# Altium schematic sheet GoodBoy_V1_nRF9160dk_sim_connector.SchDoc
size A3
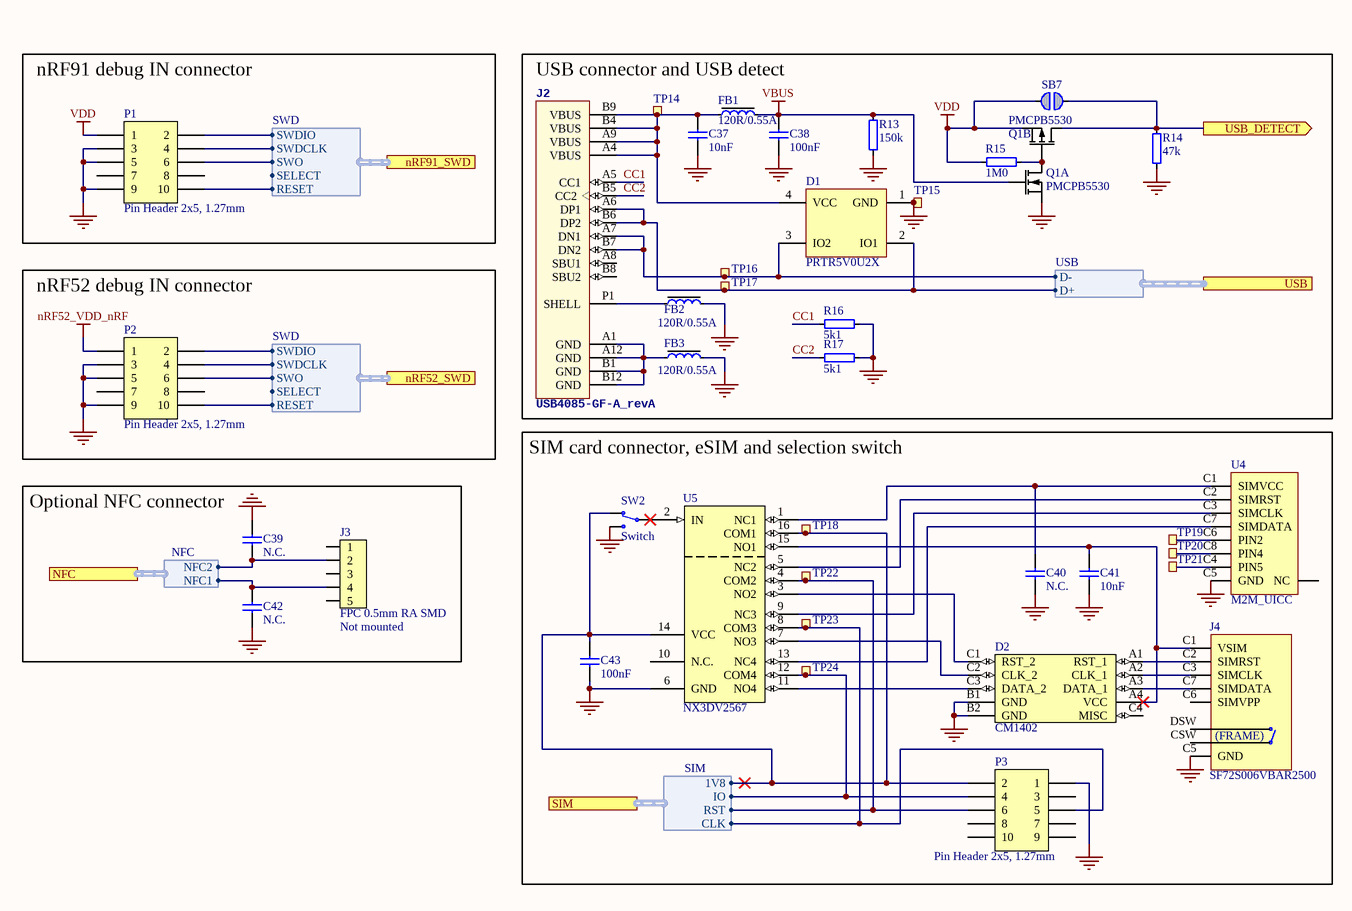
[diagram p0: GoodBoy_V1_nRF9160dk_sim_connector.SchDoc]

## Parts
C37  10nF  [CAPC0603X03L_C]
C38  100nF  [CAPC0603X03L_C]
C39  N.C.  [CAPC0603X03L_C]
C40  N.C.  [CAPC0603X03L_C]
C41  10nF  [CAPC0603X03L_C]
C42  N.C.  [CAPC0603X03L_C]
C43  100nF  [CAPC0603X03L_C]
D1  PRTR5V0U2X  [SOT190P230X110-4L]
D2  CM1402  [CM1402]
FB1  120R/0.55A  [INDC1005X04L]
FB2  120R/0.55A  [INDC1005X04L]
FB3  120R/0.55A  [INDC1005X04L]
J2  USB4085-GF-A_revA  [GCT_USB4085-GF-A_REVA]
J3  FPC 0.5mm RA SMD  Assembly: Not mounted  [FPC_05P-0.5mm-RA-SMD]
J4  SF72S006VBAR2500  [SF72S006VBAR2500]
P1  Pin Header 2x5, 1.27mm  [HDR_2x5-SMD-1.27mm-K]
P2  Pin Header 2x5, 1.27mm  [HDR_2x5-SMD-1.27mm-K]
P3  Pin Header 2x5, 1.27mm  [HDR_2x5-SMD-1.27mm]
Q1  PMCPB5530  [PMCPB5530X]  (parts A,B of 2)
R13  150k  [RESC0603X03L_C]
R14  47k  [RESC0603X03L_C]
R15  1M0  [RESC0603X03L_C]
R16  5k1  [RESC0603X03L_C]
R17  5k1  [RESC0603X03L_C]
SB7  Solderbridge  [Solderbridge]  (value not drawn)  (no BOM)
SW2  Switch  [CJS-120xA]
TP14  Ø1.5mm,SMD  [TP_SMD_Ø1.5mm]  (value not drawn)  (no BOM)
TP15  Ø1.5mm,SMD  [TP_SMD_Ø1.5mm]  (value not drawn)  (no BOM)
TP16  Ø1.5mm,SMD  [TP_SMD_Ø1.5mm]  (value not drawn)  (no BOM)
TP17  Ø1.5mm,SMD  [TP_SMD_Ø1.5mm]  (value not drawn)  (no BOM)
TP18  Ø1.5mm,SMD  [TP_SMD_Ø1.5mm]  (value not drawn)  (no BOM)
TP19  Ø1.0mm,SMD  [TP_SMD_Ø1.0mm]  (value not drawn)  (no BOM)
TP20  Ø1.0mm,SMD  [TP_SMD_Ø1.0mm]  (value not drawn)  (no BOM)
TP21  Ø1.0mm,SMD  [TP_SMD_Ø1.0mm]  (value not drawn)  (no BOM)
TP22  Ø1.5mm,SMD  [TP_SMD_Ø1.5mm]  (value not drawn)  (no BOM)
TP23  Ø1.5mm,SMD  [TP_SMD_Ø1.5mm]  (value not drawn)  (no BOM)
TP24  Ø1.5mm,SMD  [TP_SMD_Ø1.5mm]  (value not drawn)  (no BOM)
U4  M2M_UICC  [M2M_UICC]
U5  NX3DV2567  [XQFN40P180X260X50-16N]

## Blocks framed on the sheet
nRF91 debug IN connector: P1
USB connector and USB detect: C37 C38 D1 FB1-FB3 J2 Q1 R13-R17 SB7 TP14-TP17
nRF52 debug IN connector: P2
SIM card connector, eSIM and selection switch: C40 C41 C43 D2 J4 P3 SW2 TP18-TP24 U4 U5
Optional NFC connector: C39 C42 J3

## Ports
NFC (harness NFC), nRF52_SWD (harness SWD), nRF91_SWD (harness SWD), SIM (harness SIM), USB (harness USB), USB_DETECT (out)

## Harnesses
NFC: NFC1, NFC2
USB: D+, D-
SIM: CLK, IO, 1V8, RST
SWD: SWDIO, SWDCLK, SWO, RESET, SELECT

## Nets
GND: C37.1 C38.1 C39.2 C40.1 C41.2 C42.1 C43.1 D1.1(GND) D2.B1(GND) D2.B2(GND) FB2.2 FB3.2 J4.0(GND) J4.C5(GND) P1.3 P1.5 P1.9 P2.3 P2.5 P2.9 P3.1 Q1.1(S1) R13.1 R14.1 R16.1 R17.1 SW2.3(N.O) TP15.1 U4.C5(GND) U5.6(GND)
nRF52_VDD_nRF: P2.1
VBUS: C38.2 FB1.2 Q1.2(G1) R13.2
VDD: P1.1 Q1.4(S2) R15.1 SB7.1
CC1: J2.A5(CC1) R16.2
CC2: J2.B5(CC2) R17.2
USB_DETECT: Q1.3(D2) R14.2 SB7.2 ; port USB_DETECT
NetC37_2: C37.2 D1.4(VCC) FB1.1 J2.A4(VBUS) J2.A9(VBUS) J2.B4(VBUS) J2.B9(VBUS) TP14.1
NetC39_1: C39.1 J3.2 ; port NFC.NFC2
NetC40_2: C40.2 U4.C1(SIMVCC) U5.1(NC1)
NetC41_1: C41.1 D2.A4(VCC) J4.C1(VSIM) U5.15(NO1)
NetC42_2: C42.2 J3.4 ; port NFC.NFC1
NetC43_2: C43.2 P3.2 SW2.1(N.C) TP18.1 U5.14(VCC) U5.16(COM1) ; port SIM.1V8
NetD1_2: D1.2(IO1) J2.A6(DP1) J2.B6(DP2) TP17.1 ; port USB.D+
NetD1_3: D1.3(IO2) J2.A7(DN1) J2.B7(DN2) TP16.1 ; port USB.D-
NetD2_A1: D2.A1(RST_1) J4.C2(SIMRST)
NetD2_A2: D2.A2(CLK_1) J4.C3(SIMCLK)
NetD2_A3: D2.A3(DATA_1) J4.C7(SIMDATA)
NetD2_C1: D2.C1(RST_2) U5.3(NO2)
NetD2_C2: D2.C2(CLK_2) U5.7(NO3)
NetD2_C3: D2.C3(DATA_2) U5.11(NO4)
NetFB2_1: FB2.1 J2.P1(SHELL)
NetFB3_1: FB3.1 J2.A1(GND) J2.A12(GND) J2.B1(GND) J2.B12(GND)
NetP1_2: P1.2 ; port nRF91_SWD.SWDIO
NetP1_4: P1.4 ; port nRF91_SWD.SWDCLK
NetP1_6: P1.6 ; port nRF91_SWD.SWO
NetP1_10: P1.10 ; port nRF91_SWD.RESET
NetP2_2: P2.2 ; port nRF52_SWD.SWDIO
NetP2_4: P2.4 ; port nRF52_SWD.SWDCLK
NetP2_6: P2.6 ; port nRF52_SWD.SWO
NetP2_10: P2.10 ; port nRF52_SWD.RESET
NetP3_4: P3.4 TP24.1 U5.12(COM4) ; port SIM.IO
NetP3_5: P3.5 TP23.1 U5.8(COM3) ; port SIM.CLK
NetP3_6: P3.6 TP22.1 U5.4(COM2) ; port SIM.RST
NetQ1_5: Q1.5(G2) Q1.6(D1) R15.2
NetSW2_2: SW2.2(COM) U5.2(IN)
NetTP19_1: TP19.1 U4.C6(PIN2)
NetTP20_1: TP20.1 U4.C8(PIN4)
NetTP21_1: TP21.1 U4.C4(PIN5)
NetU4_C2: U4.C2(SIMRST) U5.5(NC2)
NetU4_C3: U4.C3(SIMCLK) U5.9(NC3)
NetU4_C7: U4.C7(SIMDATA) U5.13(NC4)

Not connected (* = marked no-connect by the designer): D2 C4(MISC); J2 A8(SBU1) B8(SBU2); J3 1 3 5; J4 C6(SIMVPP) CSW DSW; P1 7 8; P2 7 8; P3 3 7 8 9 10; U4 NC; U5 10(N.C.)

## Notes on the sheet
- (in symbol SF72S006VBAR2500) (FRAME)

## Library data of the parts
C37 C41 = C0201-10n: Capacitor, X7R, ±10%; Part number IPS: 00000003480; Note: 10V; Artikkelnr Noca: N.A.; Part Number: C0201-10n; Manufacturer: *; Manufacturer Part Number: *; ComponentLink1URL: *; ComponentLink1Description: Datasheet; ComponentLink2URL: *; ComponentLink2Description: Supplier link; HelpURL: *; Footprint Doc: 0201; LatestRevisionDate: 2017-11-09; Pin Count: 2; Publisher: Nordic Semiconductor; Published: 2014-11-13; Value: 10nF; Supplier 1: *; Supplier Part Number 1: *; Supplier 2: *; Supplier Part Number 2: *
C38 C43 = C0201-100n: Capacitor, X5R, ±10%; Part number IPS: 00000001248; Note: 16V; Artikkelnr Noca: N.A.; Part Number: C0201-100n; Manufacturer: *; Manufacturer Part Number: *; ComponentLink1URL: *; ComponentLink1Description: Datasheet; ComponentLink2URL: *; ComponentLink2Description: Supplier link; HelpURL: *; Footprint Doc: 0201; LatestRevisionDate: 2017-11-09; Pin Count: 2; Publisher: Nordic Semiconductor; Published: 2014-11-13; Value: 100nF; Supplier 1: *; Supplier Part Number 1: *; Supplier 2: *; Supplier Part Number 2: *
C39 C40 C42 = C0201-N.C.: Not mounted; Note: Chip Cap; Artikkelnr Noca: N.A.; Assembly: Not mounted; Part Number: C0201-N.C.; Manufacturer: *; Manufacturer Part Number: *; ComponentLink1URL: *; ComponentLink1Description: Datasheet; ComponentLink2URL: *; ComponentLink2Description: Supplier link; HelpURL: *; Footprint Doc: 0201; LatestRevisionDate: 2014-11-13; Pin Count: 2; Publisher: Nordic Semiconductor; Published: 2014-11-13; Value: N.C.; Supplier 1: *; Supplier Part Number 1: *; Supplier 2: *; Supplier Part Number 2: *; Part number IPS: N.A.
D1 = PRTR5V0U2X: Ultra low capacitance double rail-to-rail ESD protection diode; Manufacturer: NXP; Part number IPS: 00000009951; Artikkelnr Noca: 10069015; Part Number: PRTR5V0U2X; Manufacturer Part Number: PRTR5V0U2X; LatestRevisionDate: 2017-11-09; Publisher: Nordic Semiconductor; Published: 2012-06-11; Value: PRTR5V0U2X; Note: *; Footprint Doc: SOT-143B; ComponentLink1URL: *; ComponentLink1Description: Datasheet; ComponentLink2URL: *; ComponentLink2Description: Supplier link; HelpURL: http://www.farnell.com/datasheets/109718.pdf; Pin Count: 4; Supplier 1: Digi-Key; Supplier Part Number 1: 568-4140-1-ND; Supplier 2: Farnell; Supplier Part Number 2: 152-4157
D2 = CM1402: EMI Network Filter Arrays SIM CARD EMI FILTER WITH ESD PROTECTION; Manufacturer: ON Semiconductor; Manufacturer Part Number: CM1402-03CP; Part number IPS: 00000009949; Artikkelnr Noca: N.A.; Part Number: CM1402; Footprint Doc: CM1402; LatestRevisionDate: 2017-02-06; Publisher: Nordic Semiconductor; Published: 2017-02-06; Value: CM1402; Note: *; ComponentLink1URL: *; ComponentLink1Description: Datasheet; ComponentLink2URL: *; ComponentLink2Description: Supplier link; HelpURL: http://www.onsemi.com/pub_link/Collateral/CM1402-D.PDF; Pin Count: 10; Supplier 1: Digi-Key; Supplier Part Number 1: CM1402-03CPOSTR-ND; Supplier 2: Mouser; Supplier Part Number 2: 748-CM1402-03CP
FB1-FB3 = FB0402-120R@100M-500mA: Ferrite Bead, 120 Ohm @ 100MHz, 500mA, 250 mOhm Max; Manufacturer: Murata; Manufacturer Part Number: BLM15AG121SN1D; Part number IPS: 00000009954; Note: Chip EMIFIL Inductor Type Chip Ferrite Bead; Artikkelnr Noca: 33029317; Part Number: FB0402-120R@100M-500mA; Footprint Doc: 0402; LatestRevisionDate: 2014-01-10; Pin Count: 2; Publisher: Nordic Semiconductor; Published: 2011-11-14; Value: 120R/0.55A; ComponentLink1URL: *; ComponentLink1Description: Datasheet; ComponentLink2URL: *; ComponentLink2Description: Supplier link; HelpURL: http://search.murata.co.jp/Ceramy/image/img/PDF/ENG/L0110S0100BLM15A_SN.pdf; Supplier 1: Digi-Key; Supplier Part Number 1: 490-1005-1-ND; Supplier 2: Farnell; Supplier Part Number 2: 151-5760
J2 = USB4085-GF-A_revA: USB 2.0 Type C Receptacle Dip Type, PCB Top Mount; MANUFACTURER: Global Connector Technology; PARTREV: A; STANDARD: Manufacturer Recommendations
J3 = FPC_05P-0.5mm-RA-SMD: 0.5mm FPC, 5P,Right Angle SMT,Double Contact,H=1.2mm,White, Tin plated; Manufacturer: W-CON; Manufacturer Part Number: 5141-05RZDNWR01; Part number IPS: 00000007792; Artikkelnr Noca: 55010020; Part Number: FPC_05P-0.5mm-RA-SMD; Footprint Doc: FPC_05P-0.5mm-RA-SMD; LatestRevisionDate: 2016-04-21; Pin Count: 7; Publisher: Nordic Semiconductor; Published: 2015-06-22; Value: FPC 0.5mm RA SMD; Note: *; ComponentLink1URL: *; ComponentLink1Description: Datasheet; ComponentLink2URL: *; ComponentLink2Description: Supplier link; HelpURL: \\hizz\pro\app9717\Datasheet\connectores\W-CON\5141-XXRZDNXX0X.pdf; Supplier 1: Cabcon; Supplier Part Number 1: 5141-05RZDNWR01; Supplier 2: Digi-Key; Supplier Part Number 2: WM9836CT-ND
J4 = SF72S006VBAR2500: n 8 (6 + 2) Position Card Connector NANO SIM Surface Mount, Right Angle Gold; Manufacturer: JAE; Part number IPS: 00000009956; Artikkelnr Noca: N.A.; Part Number: SF72S006VBAR2500; Manufacturer Part Number: SF72S006VBAR2500; Footprint Doc: SF72S006VBAR2500; LatestRevisionDate: 2016-09-09; Pin Count: 8; Publisher: Nordic Semiconductor; Published: 2016-09-09; Value: SF72S006VBAR2500; Note: *; ComponentLink1URL: *; ComponentLink1Description: Datasheet; ComponentLink2URL: *; ComponentLink2Description: Supplier link; HelpURL: http://jae-connectors.com/en/pdf/MB-0282-1E_SF72.pdf; Supplier 1: Digi-Key; Supplier Part Number 1: 670-2799-1-ND; Supplier 2: Mouser; Supplier Part Number 2: 656-SF72S006VBAR2500
P1 P2 = Pin Header 2x5 SMD, 1.27mm, KS: Pin Header 2x5, 1.27mm (50mil), SMD, Keying Shroud; Manufacturer: W-CON; Manufacturer Part Number: 3132-10MS0BK00R1; Part number IPS: 00000009968; Artikkelnr Noca: 55010009; Part Number: Pin Header 2x5 SMD, 1.27mm, KS; Footprint Doc: HDR_2x5-SMD-1.27mm; LatestRevisionDate: 2016-04-21; Pin Count: 10; Publisher: Nordic Semiconductor; Published: 2016-01-22; Value: Pin Header 2x5, 1.27mm; Note: *; ComponentLink1URL: *; ComponentLink1Description: Datasheet; ComponentLink2URL: *; ComponentLink2Description: Supplier link; HelpURL: \\hizz\pro\app9717\Datasheet\connectores\W-CON\3132-XXMXXBK00XX.pdf; Supplier 1: Cabcon; Supplier Part Number 1: 3132-10MS0BK00R1; Supplier 2: Samtec; Supplier Part Number 2: FTSH-105-01-F-DV-K
P3 = Pin Header 2x5 SMD, 1.27mm: Pin Header 2x5, 1.27mm (50mil), SMD; Manufacturer: W-CON; Manufacturer Part Number: 1325-1205S0M078R1; Part number IPS: 00000009970; Artikkelnr Noca: 55019196; Part Number: Pin Header 2x5 SMD, 1.27mm; Footprint Doc: HDR_2x5-SMD-1.27mm; LatestRevisionDate: 2016-04-21; Pin Count: 10; Publisher: Nordic Semiconductor; Published: 2010-11-25; Value: Pin Header 2x5, 1.27mm; Note: *; ComponentLink1URL: *; ComponentLink1Description: Datasheet; ComponentLink2URL: *; ComponentLink2Description: Supplier link; HelpURL: http://www.farnell.com/datasheets/81359.pdf; Supplier 1: Cabcon; Supplier Part Number 1: 1325-1205S0M078R1; Supplier 2: Farnell; Supplier Part Number 2: 166-7759
Q1 = PMCPB5530X,115: Mosfet Array N and P-Channel 20V 4A (Ta), 3.4A (Ta) 490mW Surface Mount 6-HUSON-EP (2x2); Manufacturer: Nexperia; Artikkelnr Noca: N.A.; Part Number: PMCPB5530X,115; Manufacturer Part Number: PMCPB5530X,115; LatestRevisionDate: 2018-04-30; Pin Count: 8; Publisher: Nordic Semiconductor; Published: 2018-04-30; Value: PMCPB5530; Note: *; Footprint Doc: 6-UDFN; Part number IPS: N.A.; ComponentLink1URL: https://assets.nexperia.com/documents/data-sheet/PMCPB5530X.pdf; ComponentLink1Description: Datasheet; ComponentLink2URL: https://www.digikey.com/product-detail/en/nexperia-usa-inc/PMCPB5530X115/1727-1327-1-ND/4386339; ComponentLink2Description: Supplier link; HelpURL: https://www.nexperia.com/products/mosfets/small-signal-mosfets/PMCPB5530X.html; Supplier 1: Digi-Key; Supplier Part Number 1: 1727-1327-1-ND; Supplier 2: Mouser; Supplier Part Number 2: 771-PMCPB5530X115
R13 = R0201-150k: Resistor, ±1%, 0.05W; Part number IPS: 00000001422; Note: Chip Res 1%; Artikkelnr Noca: N.A.; Part Number: R0201-150k; Manufacturer: *; Manufacturer Part Number: *; ComponentLink1URL: *; ComponentLink1Description: Datasheet; ComponentLink2URL: *; ComponentLink2Description: Supplier link; HelpURL: *; Footprint Doc: 0201; LatestRevisionDate: 2014-11-13; Pin Count: 2; Publisher: Nordic Semiconductor; Published: 2014-11-13; Value: 150k; Supplier 1: *; Supplier Part Number 1: *; Supplier 2: *; Supplier Part Number 2: *
R14 = R0201-47k: Resistor, ±1%, 0.05W; Part number IPS: 00000001423; Note: Chip Res 1%; Artikkelnr Noca: N.A.; Part Number: R0201-47k; Manufacturer: *; Manufacturer Part Number: *; ComponentLink1URL: *; ComponentLink1Description: Datasheet; ComponentLink2URL: *; ComponentLink2Description: Supplier link; HelpURL: *; Footprint Doc: 0201; LatestRevisionDate: 2014-11-13; Pin Count: 2; Publisher: Nordic Semiconductor; Published: 2014-11-13; Value: 47k; Supplier 1: *; Supplier Part Number 1: *; Supplier 2: *; Supplier Part Number 2: *
R15 = R0201-1M0: Resistor, ±1%, 0.05W; Part number IPS: 00000001418; Note: Chip Res 1%; Artikkelnr Noca: N.A.; Part Number: R0201-1M0; Manufacturer: *; Manufacturer Part Number: *; ComponentLink1URL: *; ComponentLink1Description: Datasheet; ComponentLink2URL: *; ComponentLink2Description: Supplier link; HelpURL: *; Footprint Doc: 0201; LatestRevisionDate: 2014-11-13; Pin Count: 2; Publisher: Nordic Semiconductor; Published: 2014-11-13; Value: 1M0; Supplier 1: *; Supplier Part Number 1: *; Supplier 2: *; Supplier Part Number 2: *
R16 R17 = R0201-1k0: Resistor, ±1%, 0.05W; Part Number: ERJ-1GNJ512C; Part number IPS: 00000005786; Note: Chip Res 1%; Artikkelnr Noca: N.A.; Manufacturer: *; Manufacturer Part Number: *; ComponentLink1URL: *; ComponentLink1Description: Datasheet; ComponentLink2URL: *; ComponentLink2Description: Supplier link; HelpURL: *; Footprint Doc: 0201; LatestRevisionDate: 2014-11-13; Pin Count: 2; Published: 2014-11-13; Value: 5k1; Supplier 1: *; Supplier Part Number 1: *; Supplier 2: *; Supplier Part Number 2: *
SB7 = Solderbridge: Artikkelnr Noca: N.A.; Part Number: Solderbridge; Manufacturer: *; Manufacturer Part Number: *; LatestRevisionDate: 2009-12-14; Pin Count: 2; Publisher: Nordic Semiconductor; Published: 2009-12-14; Value: Solderbridge; Note: *; Footprint Doc: Solderbridge; Part number IPS: N.A.; ComponentLink1URL: *; ComponentLink1Description: Datasheet; ComponentLink2URL: *; ComponentLink2Description: Supplier link; HelpURL: *; Supplier 1: *; Supplier Part Number 1: *; Supplier 2: *; Supplier Part Number 2: *
SW2 = CJS-1200TA: SMD slide Switch (ON-ON); Manufacturer: Copal Electronics Inc; Part number IPS: 00000009982; Artikkelnr Noca: 50019068; Part Number: CJS-1200TA; Manufacturer Part Number: CJS-1200TA; Footprint Doc: CJS-120xA; LatestRevisionDate: 2012-10-03; Pin Count: 3; Publisher: Nordic Semiconductor; Published: 2012-10-03; Value: Switch; Note: *; ComponentLink1URL: *; ComponentLink1Description: Datasheet; ComponentLink2URL: *; ComponentLink2Description: Supplier link; HelpURL: http://media.digikey.com/pdf/Data%20Sheets/COPAL%20Electronics%20PDFs/CJS.pdf; Supplier 1: Digi-Key; Supplier Part Number 1: 563-1021-2-ND; Supplier 2: *; Supplier Part Number 2: *
TP14-TP18 TP22-TP24 = TP_SMD_Ø1.5MM: 1.0mm circular SMD testpad; Manufacturer: Nordic Semiconductor; Artikkelnr Noca: N.A.; Part Number: TP_SMD_Ø1.5MM; Manufacturer Part Number: *; ComponentLink1URL: *; ComponentLink1Description: Datasheet; ComponentLink2URL: *; ComponentLink2Description: Supplier link; HelpURL: *; Footprint Doc: TP_SMD_Ø1.5mm; LatestRevisionDate: 2016-06-02; Pin Count: 1; Publisher: Nordic Semiconductor; Published: 2016-06-02; Value: Ø1.5mm,SMD; Note: *; Part number IPS: N.A.; Supplier 1: *; Supplier Part Number 1: *; Supplier 2: *; Supplier Part Number 2: *
TP19-TP21 = TP_SMD_Ø1.0MM: 1.0mm circular SMD testpad; Manufacturer: Nordic Semiconductor; Artikkelnr Noca: N.A.; Part Number: TP_SMD_Ø1.0MM; Manufacturer Part Number: *; Footprint Doc: TP_SMD_Ø1.0mm; LatestRevisionDate: 2013-06-11; Pin Count: 1; Publisher: Nordic Semiconductor; Published: 2013-06-11; Value: Ø1.0mm,SMD; Note: *; Part number IPS: N.A.; ComponentLink1URL: *; ComponentLink1Description: Datasheet; ComponentLink2URL: *; ComponentLink2Description: Supplier link; HelpURL: *; Supplier 1: *; Supplier Part Number 1: *; Supplier 2: *; Supplier Part Number 2: *
U4 = M2M_UICC: IC, M2M UICC; Artikkelnr Noca: N.A.; Assembly: Not mounted; Part Number: M2M_UICC; Manufacturer: *; Manufacturer Part Number: *; Pin Count: 8; Value: M2M UICC; Footprint Doc: 6.0*5.0; ComponentLink1Description: Datasheet; ComponentLink2Description: Supplier link; LatestRevisionDate: 2019-02-26; Part number IPS: N.A.; Published: 2019-02-26; Publisher: Nordic Semiconductor
U5 = NX3DV2567GU: Low-ohmic four-pole double-throw analog switch; Manufacturer: NXP Semiconductors; Part number IPS: 00000007816; Artikkelnr Noca: 15079317; Part Number: NX3DV2567GU; Manufacturer Part Number: NX3DV2567GU; Footprint Doc: XQFN-16; LatestRevisionDate: 2015-02-17; Pin Count: 16; Publisher: Nordic Semiconductor; Published: 2015-02-17; Value: NX3DV2567; Note: *; ComponentLink1URL: *; ComponentLink1Description: Datasheet; ComponentLink2URL: *; ComponentLink2Description: Supplier link; HelpURL: http://www.nxp.com/documents/data_sheet/NX3DV2567.pdf; Supplier 1: Digi-Key; Supplier Part Number 1: 568-5206-1-ND; Supplier 2: Mouser; Supplier Part Number 2: 771-NX3DV2567GU115